# Altium schematic sheet AdaptadorUSB.SchDoc
size B
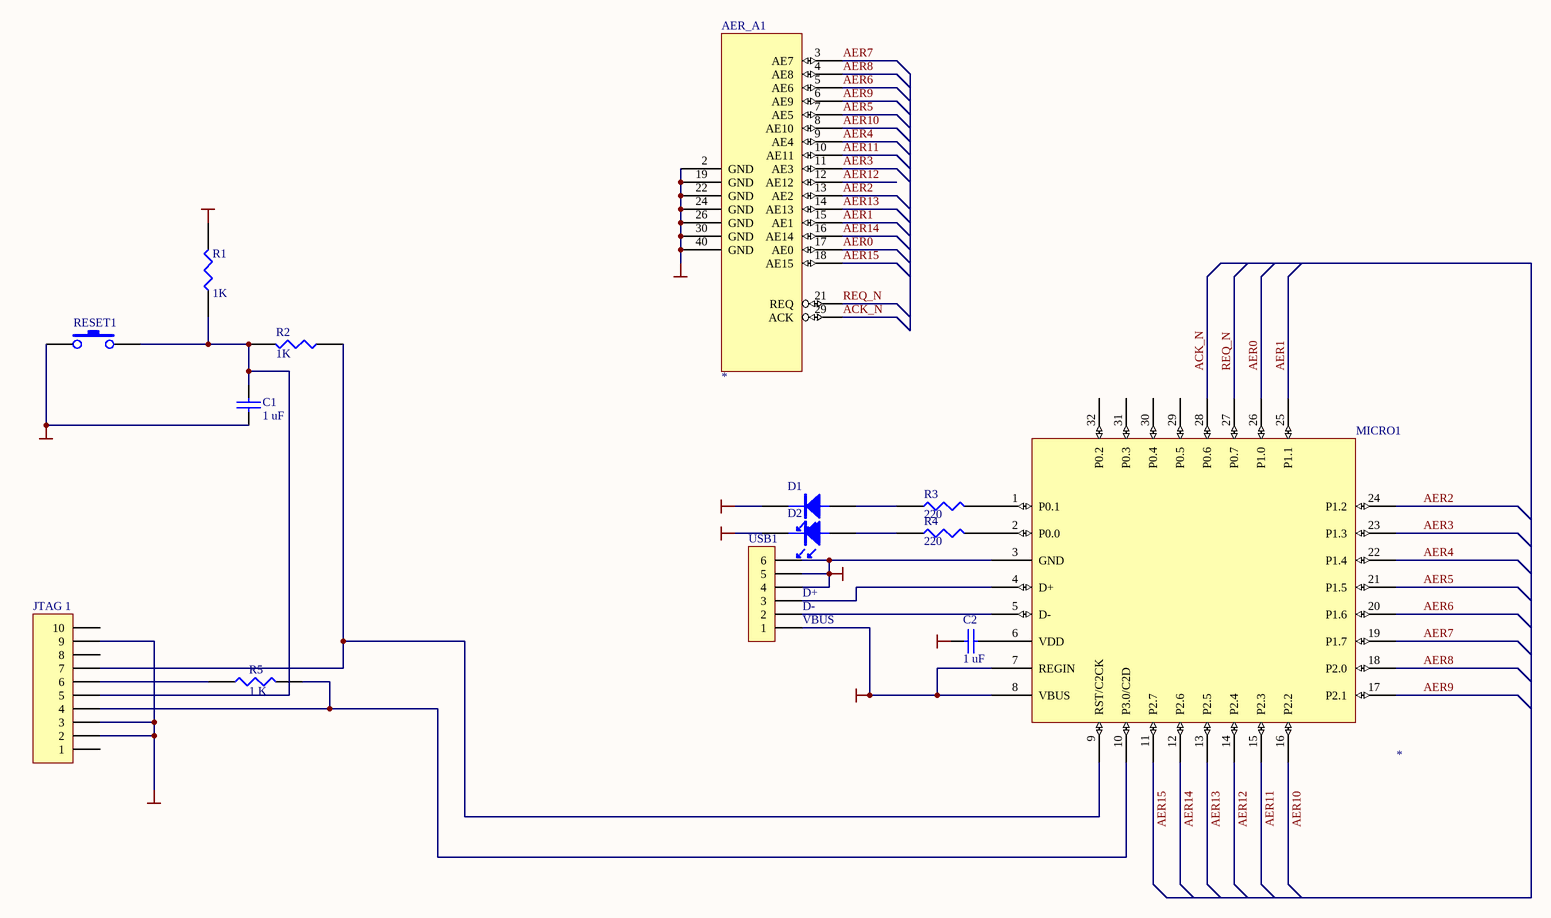
[diagram p0: AdaptadorUSB.SchDoc]

## Parts
AER_A1  *  [IDC-40]
C1  1 uF  [CAP 10]
C2  1 uF  [CAP 10]
D1  (no value)  [LED]
D2  (no value)  [LED]
JTAG_1  (no value)  [IDC-10]
MICRO1  *  [LQFP-32]
R1  1K  [AXIAL-0.4]
R2  1K  [AXIAL-0.4]
R3  220  [AXIAL-0.4]
R4  220  [AXIAL-0.4]
R5  1 K  [AXIAL-0.4]
RESET1  (no value)  [SIP-2]
USB1  (no value)  [USB_CON]

## Nets
GND: AER_A1.2(GND) AER_A1.19(GND) AER_A1.22(GND) AER_A1.24(GND) AER_A1.26(GND) AER_A1.30(GND) AER_A1.40(GND) C1.2 C2.1 D1.K D2.K JTAG_1.2 JTAG_1.3 JTAG_1.9 MICRO1.3(GND) RESET1.1 USB1.4 USB1.5 USB1.6
VCC_3.3V: MICRO1.7(REGIN) MICRO1.8(VBUS) R1.2 USB1.1
ACK_N: AER_A1.29(ACK) MICRO1.28(P0.6)
AER0: AER_A1.17(AE0) MICRO1.26(P1.0)
AER1: AER_A1.15(AE1) MICRO1.25(P1.1)
AER2: AER_A1.13(AE2) MICRO1.24(P1.2)
AER3: AER_A1.11(AE3) MICRO1.23(P1.3)
AER4: AER_A1.9(AE4) MICRO1.22(P1.4)
AER5: AER_A1.7(AE5) MICRO1.21(P1.5)
AER6: AER_A1.5(AE6) MICRO1.20(P1.6)
AER7: AER_A1.3(AE7) MICRO1.19(P1.7)
AER8: AER_A1.4(AE8) MICRO1.18(P2.0)
AER9: AER_A1.6(AE9) MICRO1.17(P2.1)
AER10: AER_A1.8(AE10) MICRO1.16(P2.2)
AER11: AER_A1.10(AE11) MICRO1.15(P2.3)
AER12: AER_A1.12(AE12) MICRO1.14(P2.4)
AER13: AER_A1.14(AE13) MICRO1.13(P2.5)
AER14: AER_A1.16(AE14) MICRO1.12(P2.6)
AER15: AER_A1.18(AE15) MICRO1.11(P2.7)
REQ_N: AER_A1.21(REQ) MICRO1.27(P0.7)
NetC1_1: C1.1 JTAG_1.5 R1.1 R2.2 RESET1.2
NetC2_2: C2.2 MICRO1.6(VDD)
NetD1_A: D1.A R3.1
NetD2_A: D2.A R4.1
NetJTAG_1_4: JTAG_1.4 MICRO1.10(P3.0/C2D) R5.2
NetJTAG_1_6: JTAG_1.6 R5.1
NetJTAG_1_7: JTAG_1.7 MICRO1.9(RST/C2CK) R2.1
NetMICRO1_1: MICRO1.1(P0.1) R3.2
NetMICRO1_2: MICRO1.2(P0.0) R4.2
NetMICRO1_4: MICRO1.4(D+) USB1.3
NetMICRO1_5: MICRO1.5(D-) USB1.2

Not connected (* = marked no-connect by the designer): JTAG_1 1 8 10; MICRO1 29(P0.5) 30(P0.4) 31(P0.3) 32(P0.2)

## Notes on the sheet
- (near USB1) VBUS
- (near USB1) D-
- (near USB1) D+

## Library data of the parts
AER_A1 = CON_AER1
C1 C2 = CAP: Capacitor
D1 D2 = LED
JTAG_1 = CON10: Connector
MICRO1 = C8051F320
R1-R5 = RES1
RESET1 = SW-PB
USB1 = CON6: Connector